# Altium schematic sheet Microcontroller.SchDoc: Microcontroller
size A4; DrawnBy: Alvin Ha; DocumentNumber: MCU2018-2; Revision: 2.0; SheetNumber: 2; SheetTotal: 4
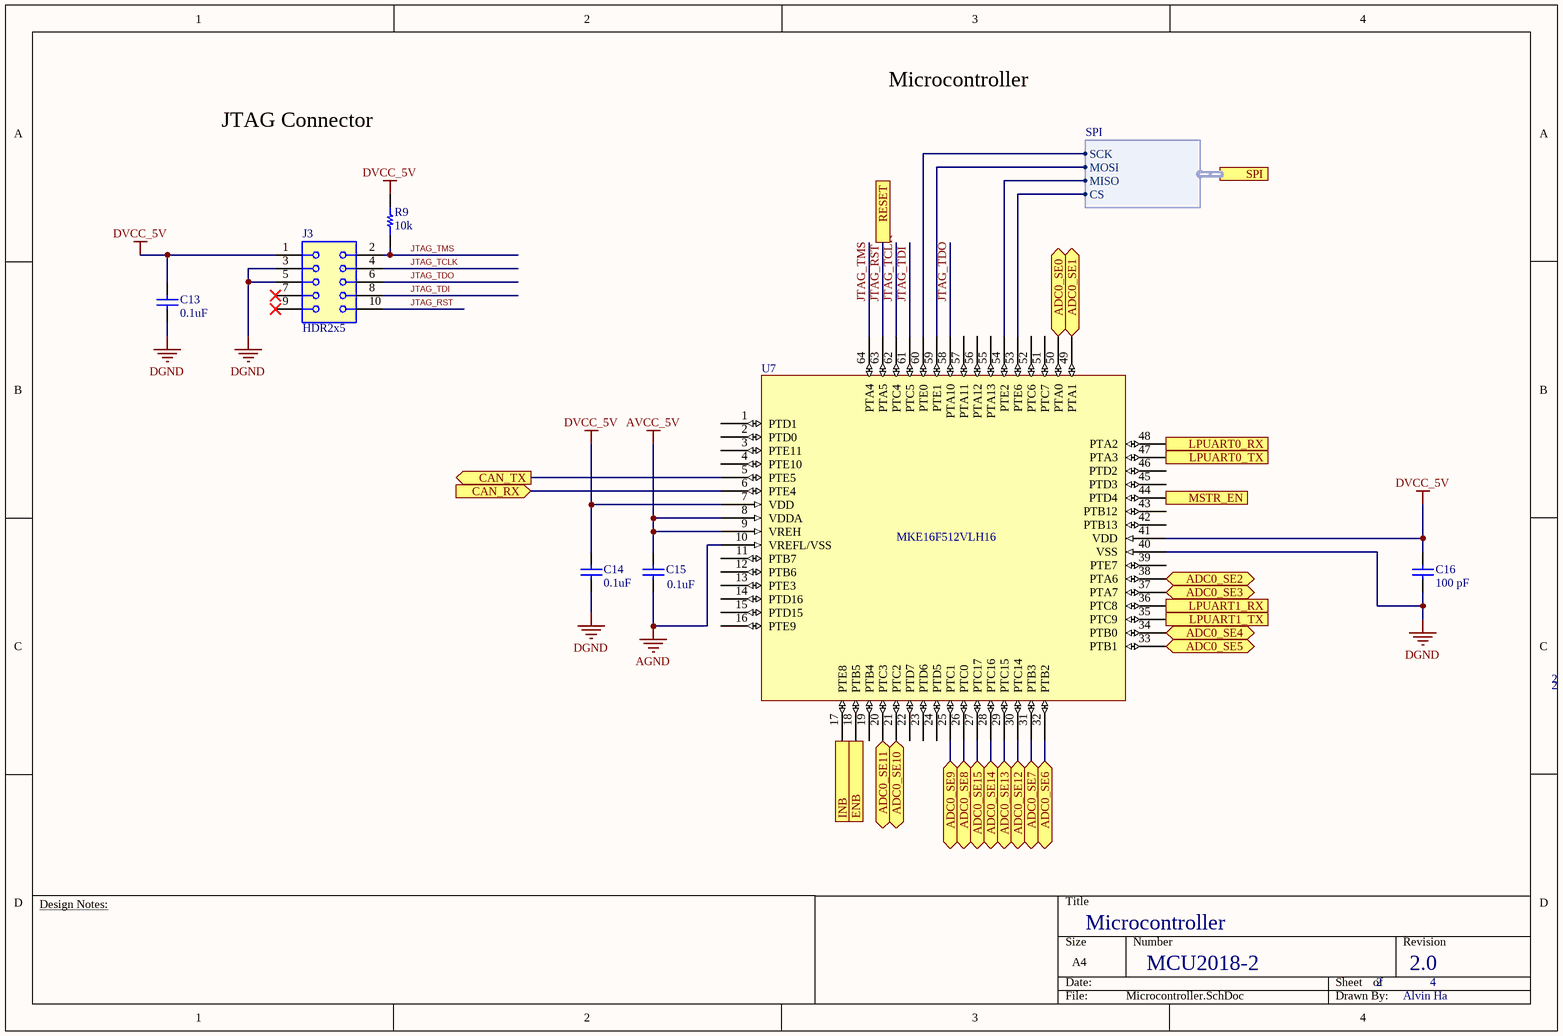
[diagram p0: Microcontroller.SchDoc]

## Parts
C13  0.1uF  [CAP SMT 0603]
C14  0.1uF  [CAP SMT 0603]
C15  0.1uF  [CAP SMT 0603]
C16  100 pF  [CAP SMT 0603]
J3  HDR2x5  [HDR 2x5]
R9  10k  [RES SMT 0805]
U7  MKE16F512VLH16  [MKE16F512VLH16]

## Ports
ADC0_SE0 (bidir), ADC0_SE1 (bidir), ADC0_SE2 (bidir), ADC0_SE3 (bidir), ADC0_SE4 (bidir), ADC0_SE5 (bidir), ADC0_SE6 (bidir), ADC0_SE7 (bidir), ADC0_SE8 (bidir), ADC0_SE9 (bidir), ADC0_SE10 (bidir), ADC0_SE11 (bidir), ADC0_SE12 (bidir), ADC0_SE13 (bidir), ADC0_SE14 (bidir), ADC0_SE15 (bidir), CAN_RX (in), CAN_TX (out), ENB (out), INB (out), LPUART0_RX (in), LPUART0_TX (out), LPUART1_RX (in), LPUART1_TX (out), MSTR_EN (out), RESET, SPI (harness SPI)

## Harnesses
SPI: MISO, CS, SCK, MOSI

## Nets
AGND: C15.1 U7.10(VREFL/VSS)
AVCC_5V: C15.2 U7.8(VDDA) U7.9(VREH)
DGND: C13.1 C14.1 C16.1 J3.3 J3.5 U7.40(VSS)
DVCC_5V: C13.2 C14.2 C16.2 J3.1 R9.2 U7.7(VDD) U7.41(VDD)
ADC0_SE0: U7.50(PTA0) ; port ADC0_SE0
ADC0_SE1: U7.49(PTA1) ; port ADC0_SE1
ADC0_SE2: U7.38(PTA6) ; port ADC0_SE2
ADC0_SE3: U7.37(PTA7) ; port ADC0_SE3
ADC0_SE4: U7.34(PTB0) ; port ADC0_SE4
ADC0_SE5: U7.33(PTB1) ; port ADC0_SE5
ADC0_SE6: U7.32(PTB2) ; port ADC0_SE6
ADC0_SE7: U7.31(PTB3) ; port ADC0_SE7
ADC0_SE8: U7.26(PTC0) ; port ADC0_SE8
ADC0_SE9: U7.25(PTC1) ; port ADC0_SE9
ADC0_SE10: U7.21(PTC2) ; port ADC0_SE10
ADC0_SE11: U7.20(PTC3) ; port ADC0_SE11
ADC0_SE12: U7.30(PTC14) ; port ADC0_SE12
ADC0_SE13: U7.29(PTC15) ; port ADC0_SE13
ADC0_SE14: U7.28(PTC16) ; port ADC0_SE14
ADC0_SE15: U7.27(PTC17) ; port ADC0_SE15
CAN_RX: U7.6(PTE4) ; port CAN_RX
CAN_TX: U7.5(PTE5) ; port CAN_TX
ENB: U7.18(PTB5) ; port ENB
INB: U7.17(PTE8) ; port INB
JTAG_RST: J3.10 U7.63(PTA5) ; port RESET
JTAG_TCLK: J3.4 U7.62(PTC4)
JTAG_TDI: J3.8 U7.61(PTC5)
JTAG_TDO: J3.6 U7.58(PTA10)
JTAG_TMS: J3.2 R9.1 U7.64(PTA4)
LPUART0_RX: U7.48(PTA2) ; port LPUART0_RX
LPUART0_TX: U7.47(PTA3) ; port LPUART0_TX
LPUART1_RX: U7.36(PTC8) ; port LPUART1_RX
LPUART1_TX: U7.35(PTC9) ; port LPUART1_TX
MSTR_EN: U7.44(PTD4) ; port MSTR_EN
NetU7_53: U7.53(PTE6) ; port SPI.CS
NetU7_54: U7.54(PTE2) ; port SPI.MISO
NetU7_59: U7.59(PTE1) ; port SPI.MOSI
NetU7_60: U7.60(PTE0) ; port SPI.SCK

Not connected (* = marked no-connect by the designer): J3 7* 9*; U7 1(PTD1) 2(PTD0) 3(PTE11) 4(PTE10) 11(PTB7) 12(PTB6) 13(PTE3) 14(PTD16) 15(PTD15) 16(PTE9) 19(PTB4) 22(PTD7) 23(PTD6) 24(PTD5) 39(PTE7) 42(PTB13) 43(PTB12) 45(PTD3) 46(PTD2) 51(PTC7) 52(PTC6) 55(PTA13) 56(PTA12) 57(PTA11)

## Notes on the sheet
- Microcontroller
- JTAG Connector
- Design Notes:

## Library data of the parts
C13-C15 = Capacitor 0.1uF 25V 0603: Supplier 1: Digi-Key; Supplier Part Number 1: 445-5667-6-ND
C16 = Capacitor 100 pF 25V 0603: Supplier 1: Digi-Key; Supplier Part Number 1: 445-4675-6-ND
R9 = Resistor 10k 1% 0805: Supplier 1: Digi-Key; Supplier Part Number 1: 541-10.0KCDKR-ND
J3 = HDR2x5: Supplier 1: Digi-Key; Supplier Part Number 1: 1175-1735-ND